# Altium schematic sheet phase.SchDoc
size 292 x 228 mm; SheetNumber: 1; SheetTotal: 2
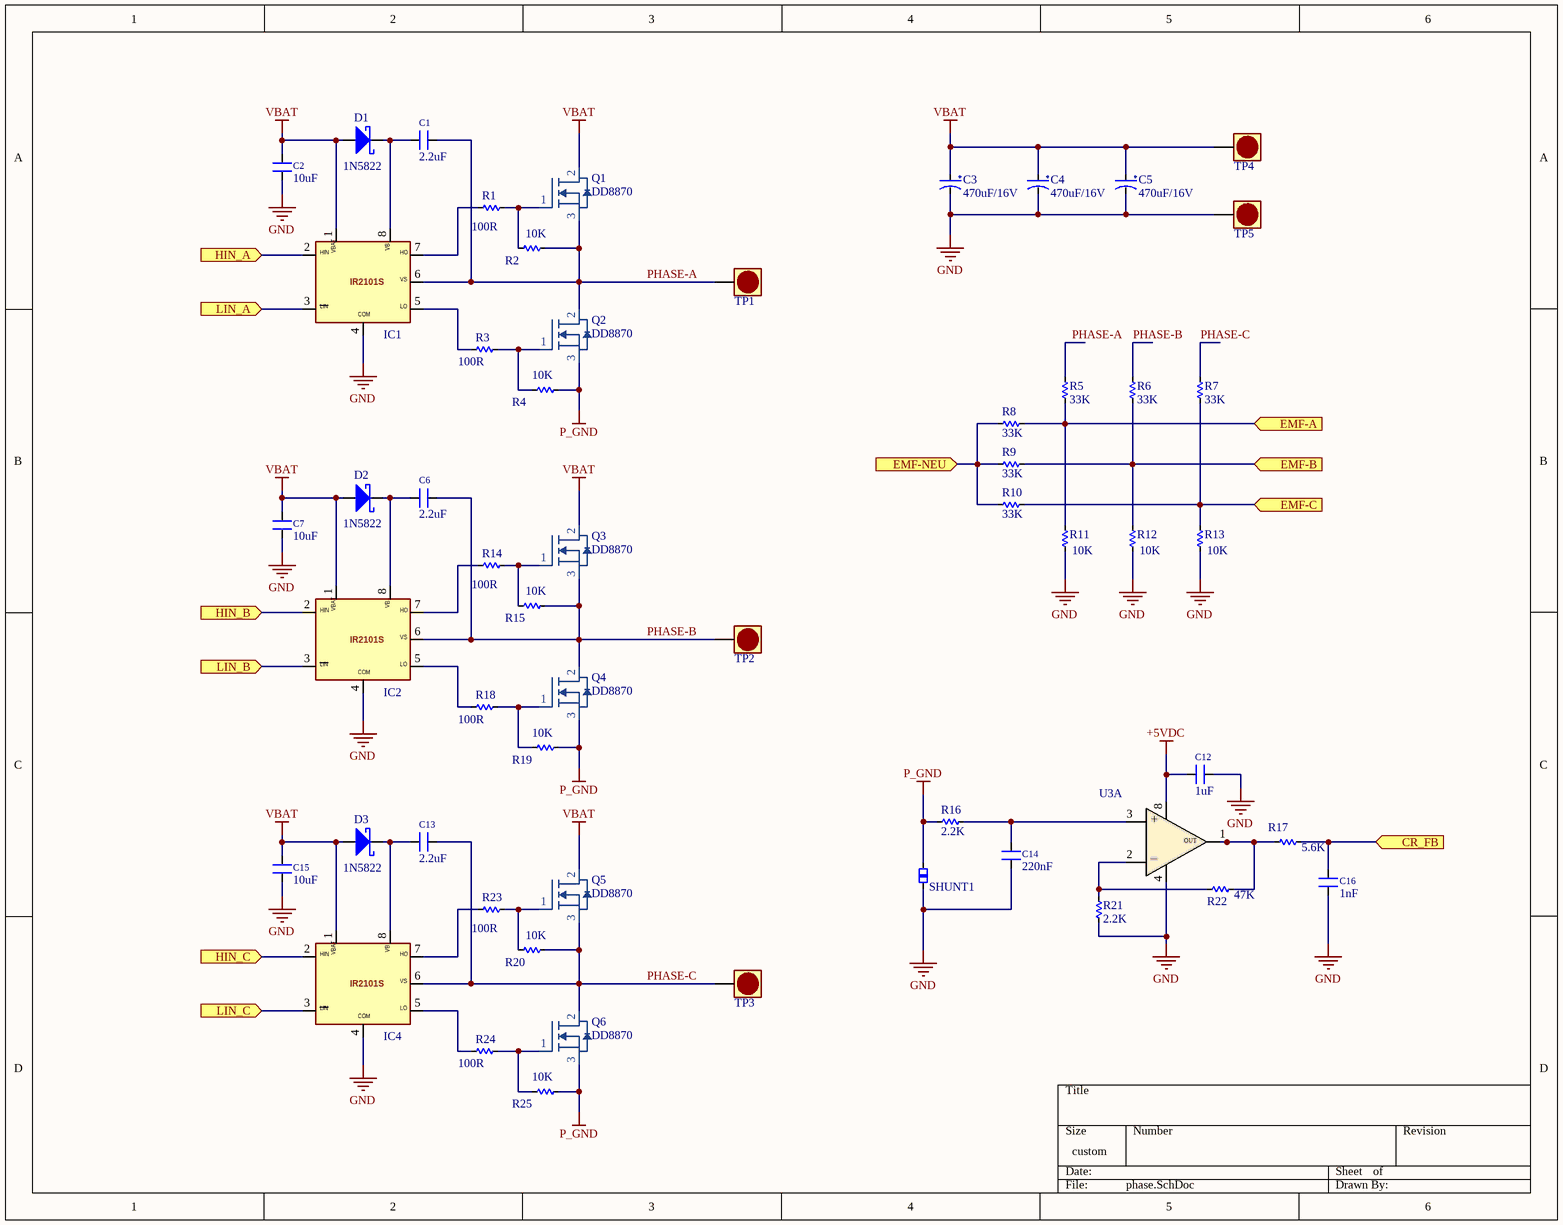
[diagram p0: phase.SchDoc]

## Parts
C1  2.2uF  [CN-SMD-0805]
C2  10uF  [SM-CAP-0805]
C3  470uF/16V  [CAP-ALU-SMD-F]
C4  470uF/16V  [CAP-ALU-SMD-F]
C5  470uF/16V  [CAP-ALU-SMD-F]
C6  2.2uF  [CN-SMD-0805]
C7  10uF  [SM-CAP-0805]
C12  1uF  [CN-SMD-0805]
C13  2.2uF  [CN-SMD-0805]
C14  220nF  [CN-SMD-0805]
C15  10uF  [SM-CAP-0805]
C16  1nF  [CN-SMD-0805]
D1  1N5822  [DO-214AC]
D2  1N5822  [DO-214AC]
D3  1N5822  [DO-214AC]
IC1  IR2101S  [SOIC-8]  (value not drawn)
IC2  IR2101S  [SOIC-8]  (value not drawn)
IC4  IR2101S  [SOIC-8]  (value not drawn)
Q1  DD8870  [TO-252]
Q2  DD8870  [TO-252]
Q3  DD8870  [TO-252]
Q4  DD8870  [TO-252]
Q5  DD8870  [TO-252]
Q6  DD8870  [TO-252]
R1  100R  [RES-SMD-0805]
R2  10K  [RES-SMD-0805]
R3  100R  [RES-SMD-0805]
R4  10K  [RES-SMD-0805]
R5  33K  [RES-SMD-0603]
R6  33K  [RES-SMD-0603]
R7  33K  [RES-SMD-0603]
R8  33K  [RES-SMD-0603]
R9  33K  [RES-SMD-0603]
R10  33K  [RES-SMD-0603]
R11  10K  [RES-SMD-0603]
R12  10K  [RES-SMD-0603]
R13  10K  [RES-SMD-0603]
R14  100R  [RES-SMD-0805]
R15  10K  [RES-SMD-0805]
R16  2.2K  [RES-SMD-0805]
R17  5.6K  [RES-SMD-0805]
R18  100R  [RES-SMD-0805]
R19  10K  [RES-SMD-0805]
R20  10K  [RES-SMD-0805]
R21  2.2K  [RES-SMD-0805]
R22  47K  [RES-SMD-0805]
R23  100R  [RES-SMD-0805]
R24  100R  [RES-SMD-0805]
R25  10K  [RES-SMD-0805]
SHUNT1  Shunt  [SHUNT10MM]  (value not drawn)
TP1  JP1P  [PW-JP]  (value not drawn)
TP2  JP1P  [PW-JP]  (value not drawn)
TP3  JP1P  [PW-JP]  (value not drawn)
TP4  JP1P  [PW-JP]  (value not drawn)
TP5  JP1P  [PW-JP]  (value not drawn)
U3  MCP6002  [DIP-8]  (value not drawn)  (part A of 2)

## Ports
CR_FB (in), EMF-A (in), EMF-B (in), EMF-C (in), EMF-NEU (in), HIN_A (in), HIN_B (in), HIN_C (in), LIN_A (in), LIN_B (in), LIN_C (in)

## Nets
+5VDC: C12.1 U3.8
GND: C2.1 C3.2 C4.2 C5.2 C7.1 C12.2 C14.1 C15.1 C16.2 IC1.4 IC2.4 IC4.4 R11.2 R12.2 R13.2 R21.1 SHUNT1.1 TP5.1 U3.4
P_GND: Q2.3 Q4.3 Q6.3 R4.2 R16.1 R19.2 R25.2 SHUNT1.2
VBAT: C2.2 C3.1 C4.1 C5.1 C7.2 C15.2 D1.1 D2.1 D3.1 IC1.1 IC2.1 IC4.1 Q1.2 Q3.2 Q5.2 TP4.1
CR_FB: C16.1 R17.2 ; port CR_FB
EMF-A: R5.2 R8.2 R11.1 ; port EMF-A
EMF-B: R6.2 R9.2 R12.1 ; port EMF-B
EMF-C: R7.2 R10.2 R13.1 ; port EMF-C
EMF-NEU: R8.1 R9.1 R10.1 ; port EMF-NEU
HIN_A: IC1.2 ; port HIN_A
HIN_B: IC2.2 ; port HIN_B
HIN_C: IC4.2 ; port HIN_C
LIN_A: IC1.3 ; port LIN_A
LIN_B: IC2.3 ; port LIN_B
LIN_C: IC4.3 ; port LIN_C
PHASE-A: C1.2 IC1.6 Q1.3 Q2.2 R2.2 R5.1 TP1.1
PHASE-B: C6.2 IC2.6 Q3.3 Q4.2 R6.1 R15.2 TP2.1
PHASE-C: C13.2 IC4.6 Q5.3 Q6.2 R7.1 R20.2 TP3.1
NetC1_1: C1.1 D1.2 IC1.8
NetC6_1: C6.1 D2.2 IC2.8
NetC13_1: C13.1 D3.2 IC4.8
NetC14_2: C14.2 R16.2 U3.3
NetIC1_5: IC1.5 R3.2
NetIC1_7: IC1.7 R1.2
NetIC2_5: IC2.5 R18.2
NetIC2_7: IC2.7 R14.2
NetIC4_5: IC4.5 R24.2
NetIC4_7: IC4.7 R23.2
NetQ1_1: Q1.1 R1.1 R2.1
NetQ2_1: Q2.1 R3.1 R4.1
NetQ3_1: Q3.1 R14.1 R15.1
NetQ4_1: Q4.1 R18.1 R19.1
NetQ5_1: Q5.1 R20.1 R23.1
NetQ6_1: Q6.1 R24.1 R25.1
NetR17_1: R17.1 R22.2 U3.1
NetR21_2: R21.2 R22.1 U3.2

## Notes on the sheet
- (in symbol IR2101S) VB; HIN; VBAT; HO; VS; LIN; LO; COM
- (in symbol MCP6002, part A) +; OUT; _

## Library data of the parts
C1 C2 C6 C7 C12-C16 = CAP SMD: Value: 0,1uF/300V; Designed by: VanDungEvn
C3-C5 = CAP-ALU-SMD: Published: 8-Jun-2000; LatestRevisionDate: 17-Jul-2002; LatestRevisionNote: Re-released for DXP Platform.; PackageReference: POLAR0.8; Publisher: Altium Limited
D1-D3 = Diode Schottky: Part Number: LED 3 ly Single Colour; Pricing: *
Q1-Q6 = MOSFET-N: MOSFET N chane
R1-R25 = Res-SMD: Resistor; Manufacturer: Generic Components; Class: Passive; Published: 08/06/2000; Publisher: Altium Hobart Technology Centre